# EAGLE design shem (EAGLE 8.0.2)
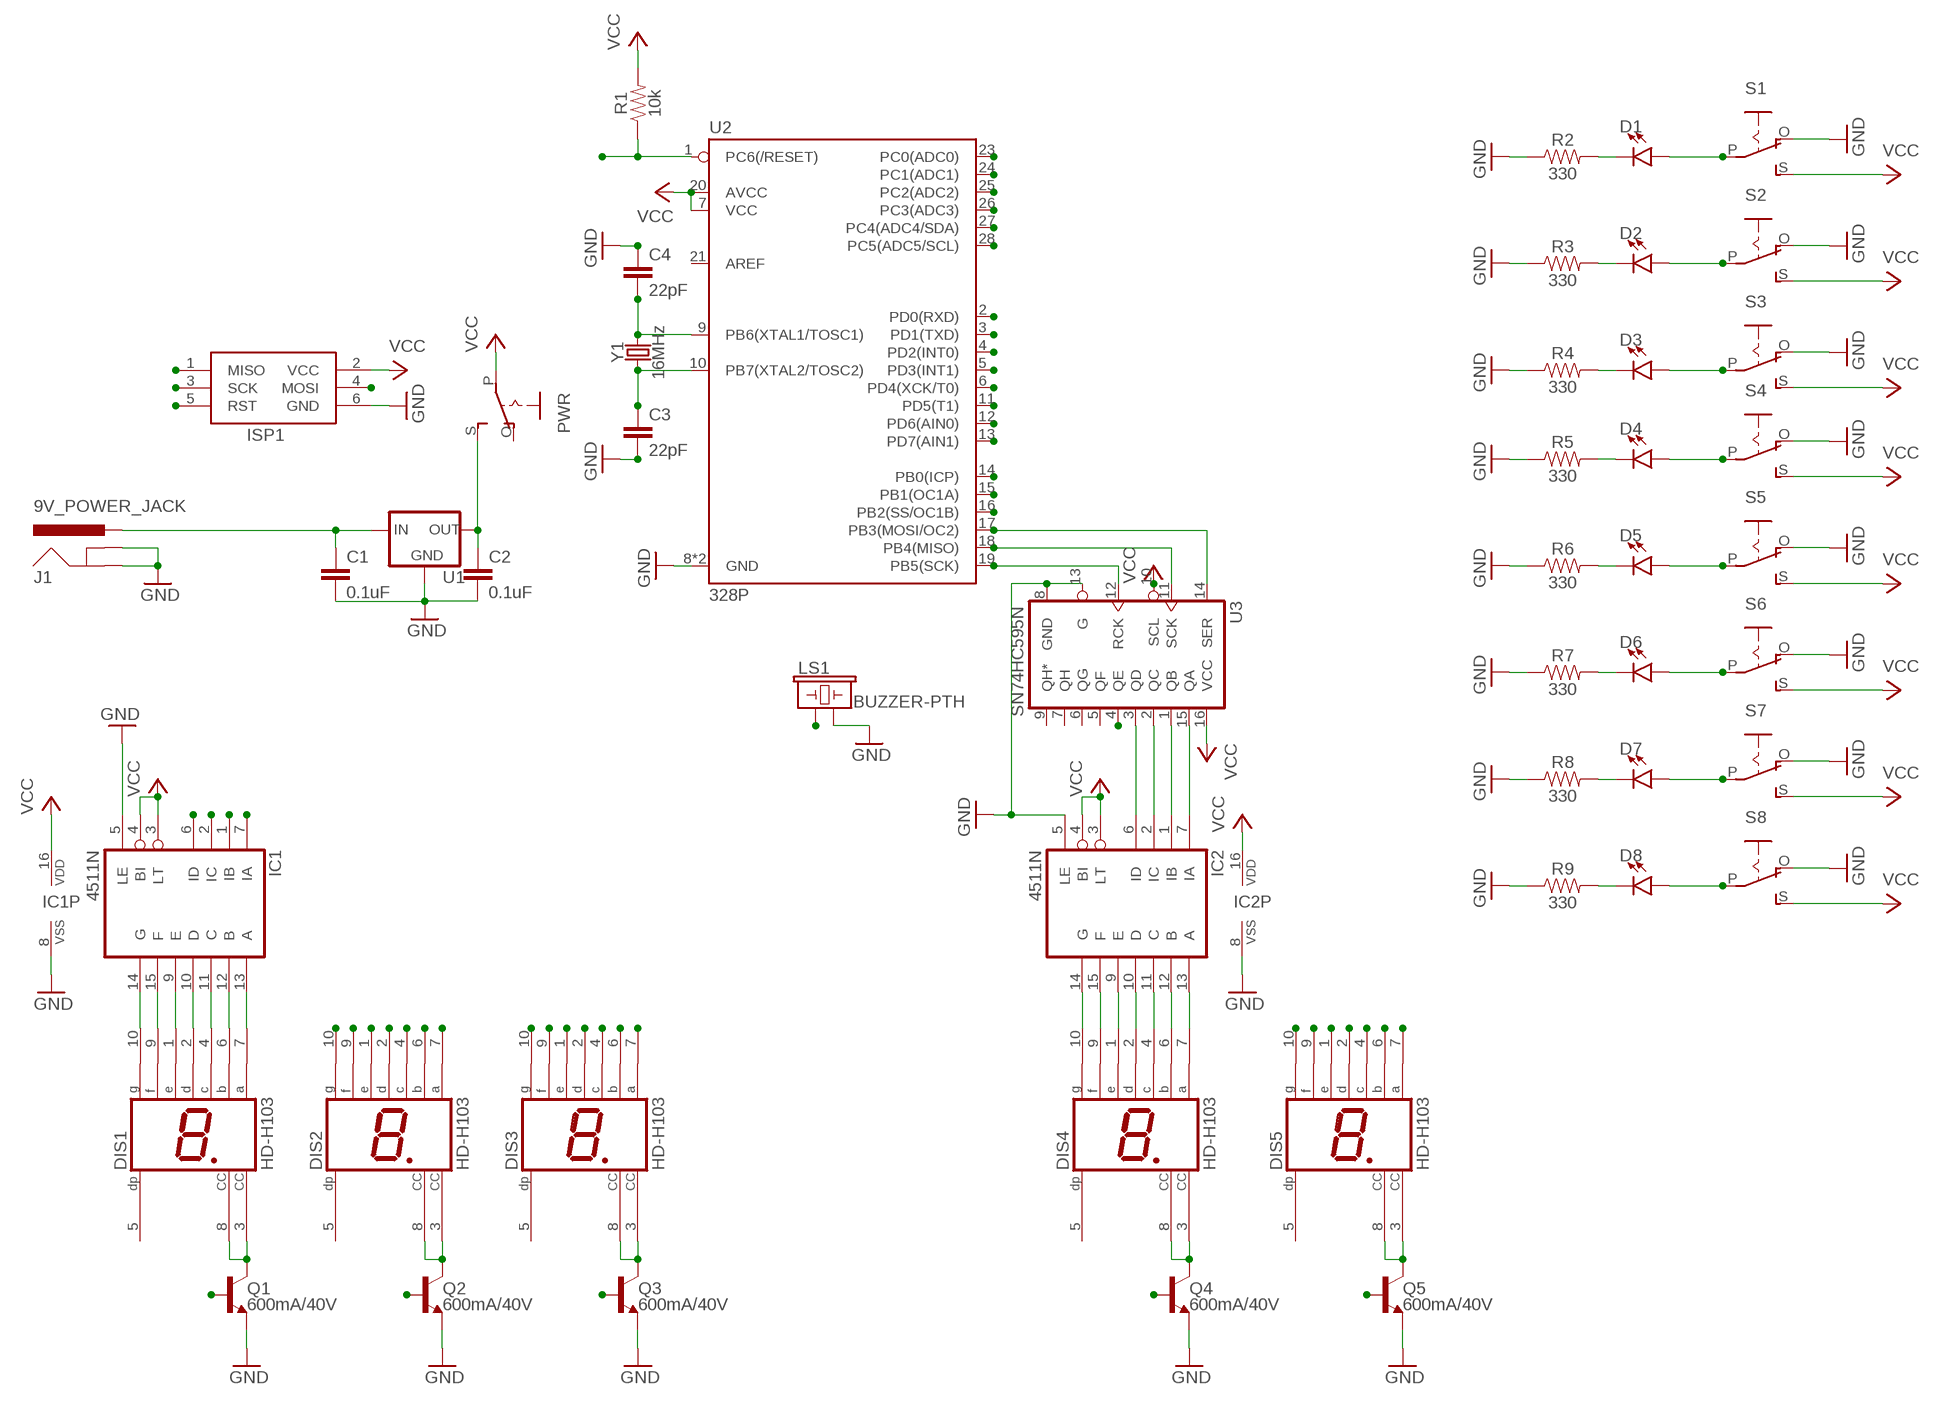
[diagram p0: schematic, sheet 1]

## Parts
C1  0.1uF  0.1UF-KIT-EZ-50V-20%  [CAP-PTH-SMALL-KIT]
C2  0.1uF  0.1UF-KIT-EZ-50V-20%  [CAP-PTH-SMALL-KIT]
C3  22pF  22PF-PTH-2.54MM-200V-5%  [CAP-PTH-2.54]
C4  22pF  22PF-PTH-2.54MM-200V-5%  [CAP-PTH-2.54]
D1  LED3MM  [LED_3MM]
D2  LED3MM  [LED_3MM]
D3  LED3MM  [LED_3MM]
D4  LED3MM  [LED_3MM]
D5  LED3MM  [LED_3MM]
D6  LED3MM  [LED_3MM]
D7  LED3MM  [LED_3MM]
D8  LED3MM  [LED_3MM]
DIS1  HD-H103  [HDSP-M]
DIS2  HD-H103  [HDSP-M]
DIS3  HD-H103  [HDSP-M]
DIS4  HD-H103  [HDSP-M]
DIS5  HD-H103  [HDSP-M]
IC1  4511N  [DIL16]
IC2  4511N  [DIL16]
ISP1  AVRISP-6  [AVRISP]
J1  9V_POWER_JACK  POWER_JACK  [POWER_JACK_PTH]
LS1  BUZZER-PTH  [BUZZER-12MM]
PWR  EG1218S  [EG1218]
Q1  600mA/40V  TRANS_NPN-P2N2222A  [TO-92]
Q2  600mA/40V  TRANS_NPN-P2N2222A  [TO-92]
Q3  600mA/40V  TRANS_NPN-P2N2222A  [TO-92]
Q4  600mA/40V  TRANS_NPN-P2N2222A  [TO-92]
Q5  600mA/40V  TRANS_NPN-P2N2222A  [TO-92]
R1  10k  10KOHM-HORIZ-1/6W-5%  [AXIAL-0.3]
R2  330  330OHM-HORIZ-1/10W-5%  [AXIAL-0.3]
R3  330  330OHM-HORIZ-1/10W-5%  [AXIAL-0.3]
R4  330  330OHM-HORIZ-1/10W-5%  [AXIAL-0.3]
R5  330  330OHM-HORIZ-1/10W-5%  [AXIAL-0.3]
R6  330  330OHM-HORIZ-1/10W-5%  [AXIAL-0.3]
R7  330  330OHM-HORIZ-1/10W-5%  [AXIAL-0.3]
R8  330  330OHM-HORIZ-1/10W-5%  [AXIAL-0.3]
R9  330  330OHM-HORIZ-1/10W-5%  [AXIAL-0.3]
S1  EG1218S  [EG1218]
S2  EG1218S  [EG1218]
S3  EG1218S  [EG1218]
S4  EG1218S  [EG1218]
S5  EG1218S  [EG1218]
S6  EG1218S  [EG1218]
S7  EG1218S  [EG1218]
S8  EG1218S  [EG1218]
U1  V_REG_78XXSIDE  [78XXL]
U2  328P  ATMEGA328P_PDIP  [DIP28]
U3  SN74HC595N  74HC595N  [DIP16]
Y1  16MHz  CRYSTAL-16MHZPTH-HC49US  [HC49US]

## Nets
9V: C1.1 J1.PWR U1.IN
BUZZ: LS1.+ U3.4(QE)
GND: C1.2 C2.2 C3.2 C4.1 IC1.5(LE) IC1.8(VSS) IC2.5(LE) IC2.8(VSS) ISP1.6(GND) J1.GND J1.GNDBREAK LS1.- Q1.3(E) Q2.3(E) Q3.3(E) Q4.3(E) Q5.3(E) R2.P$1 R3.P$1 R4.P$1 R5.P$1 R6.P$1 R7.P$1 R8.P$1 R9.P$1 S1.O S2.O S3.O S4.O S5.O S6.O S7.O S8.O U1.GND U2.8(GND) U2.22(GND) U3.8(GND) U3.13(G)
HUNDREDS_ENABLE: Q1.2(B) U2.16(PB2(SS/OC1B))
IA: IC1.7(IA) U2.23(PC0(ADC0))
IB: IC1.1(IB) U2.24(PC1(ADC1))
IC: IC1.2(IC) U2.25(PC2(ADC2))
ID: IC1.6(ID) U2.26(PC3(ADC3))
MISO: ISP1.1(MISO) U2.18(PB4(MISO)) U3.11(SCK)
MOSI: ISP1.4(MOSI) U2.17(PB3(MOSI/OC2)) U3.14(SER)
N$1: C2.1 PWR.S U1.OUT
N$2: C3.1 U2.10(PB7(XTAL2/TOSC2)) Y1.1
N$3: C4.2 U2.9(PB6(XTAL1/TOSC1)) Y1.2
N$4: DIS1.3(CC) DIS1.8(CC) Q1.1(C)
N$5: IC2.7(IA) U3.15(QA)
N$6: DIS2.3(CC) DIS2.8(CC) Q2.1(C)
N$7: IC2.1(IB) U3.1(QB)
N$8: DIS3.3(CC) DIS3.8(CC) Q3.1(C)
N$9: IC2.2(IC) U3.2(QC)
N$10: IC2.6(ID) U3.3(QD)
N$11: DIS4.3(CC) DIS4.8(CC) Q4.1(C)
N$12: D1.K(C) R2.P$2
N$13: D8.K(C) R9.P$2
N$14: D7.K(C) R8.P$2
N$15: D6.K(C) R7.P$2
N$16: DIS5.3(CC) DIS5.8(CC) Q5.1(C)
N$17: D5.K(C) R6.P$2
N$18: D4.K(C) R5.P$2
N$19: D3.K(C) R4.P$2
N$20: D2.K(C) R3.P$2
NUM_A: DIS1.7(A) DIS2.7(A) DIS3.7(A) IC1.13(A)
NUM_B: DIS1.6(B) DIS2.6(B) DIS3.6(B) IC1.12(B)
NUM_C: DIS1.4(C) DIS2.4(C) DIS3.4(C) IC1.11(C)
NUM_D: DIS1.2(D) DIS2.2(D) DIS3.2(D) IC1.10(D)
NUM_E: DIS1.1(E) DIS2.1(E) DIS3.1(E) IC1.9(E)
NUM_F: DIS1.9(F) DIS2.9(F) DIS3.9(F) IC1.15(F)
NUM_G: DIS1.10(G) DIS2.10(G) DIS3.10(G) IC1.14(G)
ONES_ENABLE: Q3.2(B) U2.14(PB0(ICP))
RST: ISP1.5(RST) R1.P$1 U2.1(PC6(/RESET))
S0: D1.A S1.P U2.2(PD0(RXD))
S1: D2.A S2.P U2.3(PD1(TXD))
S2: D3.A S3.P U2.4(PD2(INT0))
S3: D4.A S4.P U2.5(PD3(INT1))
S4: D5.A S5.P U2.6(PD4(XCK/T0))
S5: D6.A S6.P U2.11(PD5(T1))
S6: D7.A S7.P U2.12(PD6(AIN0))
S7: D8.A S8.P U2.13(PD7(AIN1))
SCK: ISP1.3(SCK) U2.19(PB5(SCK)) U3.12(RCK)
SCORE_A: DIS4.7(A) DIS5.7(A) IC2.13(A)
SCORE_B: DIS4.6(B) DIS5.6(B) IC2.12(B)
SCORE_C: DIS4.4(C) DIS5.4(C) IC2.11(C)
SCORE_D: DIS4.2(D) DIS5.2(D) IC2.10(D)
SCORE_E: DIS4.1(E) DIS5.1(E) IC2.9(E)
SCORE_F: DIS4.9(F) DIS5.9(F) IC2.15(F)
SCORE_G: DIS4.10(G) DIS5.10(G) IC2.14(G)
SCORE_ONES_ENABLE: Q4.2(B) U2.28(PC5(ADC5/SCL))
SCORE_TENS_ENABLE: Q5.2(B) U2.27(PC4(ADC4/SDA))
TENS_ENABLE: Q2.2(B) U2.15(PB1(OC1A))
VCC: IC1.3(LT) IC1.4(BI) IC1.16(VDD) IC2.3(LT) IC2.4(BI) IC2.16(VDD) ISP1.2(VCC) PWR.P R1.P$2 S1.S S2.S S3.S S4.S S5.S S6.S S7.S S8.S U2.7(VCC) U2.20(AVCC) U3.10(SCL) U3.16(VCC)
Unconnected: DIS1.5(DP) DIS2.5(DP) DIS3.5(DP) DIS4.5(DP) DIS5.5(DP) PWR.O U2.21(AREF) U3.5(QF) U3.6(QG) U3.7(QH) U3.9(QH*)

## Library data of the parts
C1 C2 = SparkFun-Capacitors:0.1UF: 0.1µF ceramic capacitors A capacitor is a passive two-terminal electrical component used to store electrical energy temporarily in an electric field.; PROD_ID: CAP-08370
C3 C4 = SparkFun-Capacitors:22PF: 22pF ceramic capacitors A capacitor is a passive two-terminal electrical component used to store electrical energy temporarily in an electric field.; PROD_ID: CAP-09128
D1-D8 = SparkFun-LED:LED: LED (Generic) Standard schematic elements and footprints for 5mm, 3mm, 1206, and 0603 sized LEDs. Generic LEDs with no color specified.; PROD_ID: DIO-08794
DIS1-DIS5 = display-hp:HD-H103: LED DISPLAY 1-character 7 segment, decimal point right; OC_FARNELL: unknown; OC_NEWARK: unknown
IC1 IC2 = 45xx:4511: BCD to 7-segment LATCH/DECODER/DRIVER
ISP1 = adafruit:AVRISP: AVR ISP HEADER Standard 6 pin header for AVR programming
J1 = SparkFun-Connectors:POWER_JACK: Power Jack Connector This is the standard 5.5mm barrel jack for power. The PTH is the most common, proven, reliable, footprint. The Slot footprint only works if the mill layer is transmitted to the PCB fab house so be warned. Here are the connectors we sell at SparkFun: DC Barrel Power Jack/Connector <https://www.sparkfun.com/products/119> (PRT-00119) DC Barrel Power Jack/Connector (SMD) <https://www.sparkfun.com/products/12748> (PRT-12748) DC Barrel Jack Adapter - Breadboard Compatible <https://www.sparkfun.com/products/10811> (PRT-10811) It is used on this SparkFun product (and many, many others): SparkFun RedBoard - Programmed with Arduino <https://www.sparkfun.com/products/12757> (DEV-12757) Also, if you need a mating power supply or connector, please check these out: Wall Adapter Power Supply - 9VDC 650mA <https://www.sparkfun.com/products/298> (TOL-00298) DC Barrel Jack Adapter - Male <https://www.sparkfun.com/products/10287> (PRT-10287); PROD_ID: CONN-08197
LS1 = SparkFun-Electromechanical:BUZZER: Buzzer Small round buzzers that operate around the audible 2kHz range. You can use these as speakers to create simple music or user interfaces. Variant Overview: PTH - Mini Speaker - PC Mount 12mm 2.048kHz <https://www.sparkfun.com/products/7950> PTH_KIT - Mini Speaker - PC Mount 12mm 2.048kHz <https://www.sparkfun.com/products/7950> KIT simplifies soldering by adding stop mask to one side of the pads. PTH_NO_SILK - Mini Speaker - PC Mount 12mm 2.048kHz <https://www.sparkfun.com/products/7950> No silkscreen indicator of buzzer outline. PTH_KIT_NO_SILK - Mini Speaker - PC Mount 12mm 2.048kHz <https://www.sparkfun.com/products/7950> KIT package w/o silkscreen SMD - Buzzer Audio Magnetic (CCV-084B16) SMD buzzer used on, e.g. the LilyPad Buzzer <https://www.sparkfun.com/products/8463> and RFID USB Reader <https://www.sparkfun.com/products/9963>. SMD_KIT - Buzzer Audio Magnetic (CCV-084B16) SMD Buzzer with elongated pins to make soldering easier. Used on the SparkFun Simon Says - Surface Mount Soldering Kit <https://www.sparkfun.com/products/10935>.; PROD_ID: COMP-08253; SF_SKU: COM-07950
PWR S1-S8 = adafruit:EG1218: SLIDING SWITCH 0.1" spacing through hole, vertical SPDT slide switch http://www.ladyada.net/library/pcb/eaglelibrary.html
Q1-Q5 = SparkFun-DiscreteSemi:TRANS_NPN: NPN transistor Current controlled devices typically used to amplify current or used as a switch. BC547 - COM-08928 <http://www.sparkfun.com/products/8928> (TO-92 45V 100mA) (1.Collector 2.Base 3.Emitter) 2N3904 - COM-00521 <http://www.sparkfun.com/products/521> (TO-92 40V 200mA) (1.Emitter 2.Base 3.Collector) P2N2222A - COM-12852 <http://www.sparkfun.com/products/12852> (TO-92 40V 600mA) (1.Collector 2.Base 3.Emitter); PROD_ID: TRANS-09536
R1 = SparkFun-Resistors:10KOHM: 10kΩ resistor A resistor is a passive two-terminal electrical component that implements electrical resistance as a circuit element. Resistors act to reduce current flow, and, at the same time, act to lower voltage levels within circuits. - Wikipedia; PROD_ID: RES-08375
R2-R9 = SparkFun-Resistors:330OHM: 330Ω resistor A resistor is a passive two-terminal electrical component that implements electrical resistance as a circuit element. Resistors act to reduce current flow, and, at the same time, act to lower voltage levels within circuits. - Wikipedia; PROD_ID: RES-8371
U1 = SparkFun-IC-Power:V_REG_78XX: Voltage Regulator Standard 78xx regulator. IGO (Input Ground Output). Spark Fun Electronics SKU : COM-00107
U2 = SparkFun-IC-Microcontroller:ATMEGA328P_PDIP: Atmel 328P Through hole ATMEGA328P uC used in the Arduino 32kb flash, 1k EEPROM, 2k SRAM Datasheet <http://www.sparkfun.com/datasheets/Components/SMD/ATMega328.pdf> SparkFun Products Storefront component: AVR 28 Pin 20MHz 32K 6A/D - ATMega328P <https://www.sparkfun.com/products/9061> (COM-09061) SparkFun Simon Says - Through-Hole Soldering Kit <https://www.sparkfun.com/products/10547> (KIT-10547) SparkFun Learn to Solder - Simon Says <https://www.sparkfun.com/products/13708> (KIT-13708) SparkFun BigTime Watch Kit <https://www.sparkfun.com/products/11734> (KIT-11734) SparkFun ClockIt <https://www.sparkfun.com/products/10930> (KIT-10930) SparkFun Serial Enabled LCD Kit <https://www.sparkfun.com/products/10097> (LCD-10097) SparkFun Simon Tilts - Through Hole Soldering Kit <https://www.sparkfun.com/products/12634> (KIT-12634) SparkFun Frequency Counter Kit <https://www.sparkfun.com/products/10140> (KIT-10140) FabFM Radio Kit <https://www.sparkfun.com/products/11043> (KIT-11043) SparkFun Binary Blaster Kit <https://www.sparkfun.com/products/12037> (KIT-12037) SparkFun Metro-Gnome <https://www.sparkfun.com/products/9236> (KIT-09236) ATmega328 with Arduino Optiboot (Uno) <https://www.sparkfun.com/products/10524> (DEV-10524); PROD_ID: IC-09136
U3 = SparkFun-IC-Logic:74*595: 8-Bit Shift Register (Serial to Parallel) Datasheet <http://cdn.sparkfun.com/datasheets/BreakoutBoards/MM74HC595.pdf> SparkFun Products SparkFun Shift Register Breakout - 74HC595 <https://www.sparkfun.com/products/10680> (BOB-10680); PROD_ID: IC-13123
Y1 = SparkFun-Clocks:CRYSTAL-16MHZ: 16MHz Crystal Digikey Example <http://www.digikey.com/product-search/en?keywords=535-9122-1-ND> Frequency: 16MHz Frequency Stability: ±50ppm Frequency Tolerance: ±20ppm Load Capacitance: 18pF SparkFun Products: Pro Micro -5V/16MHz <https://www.sparkfun.com/products/12640> SparkFun Serial Enabled LCD Kit <https://www.sparkfun.com/products/10097>; PROD_ID: XTAL-08181; SF_ID: COM-00536

## Board
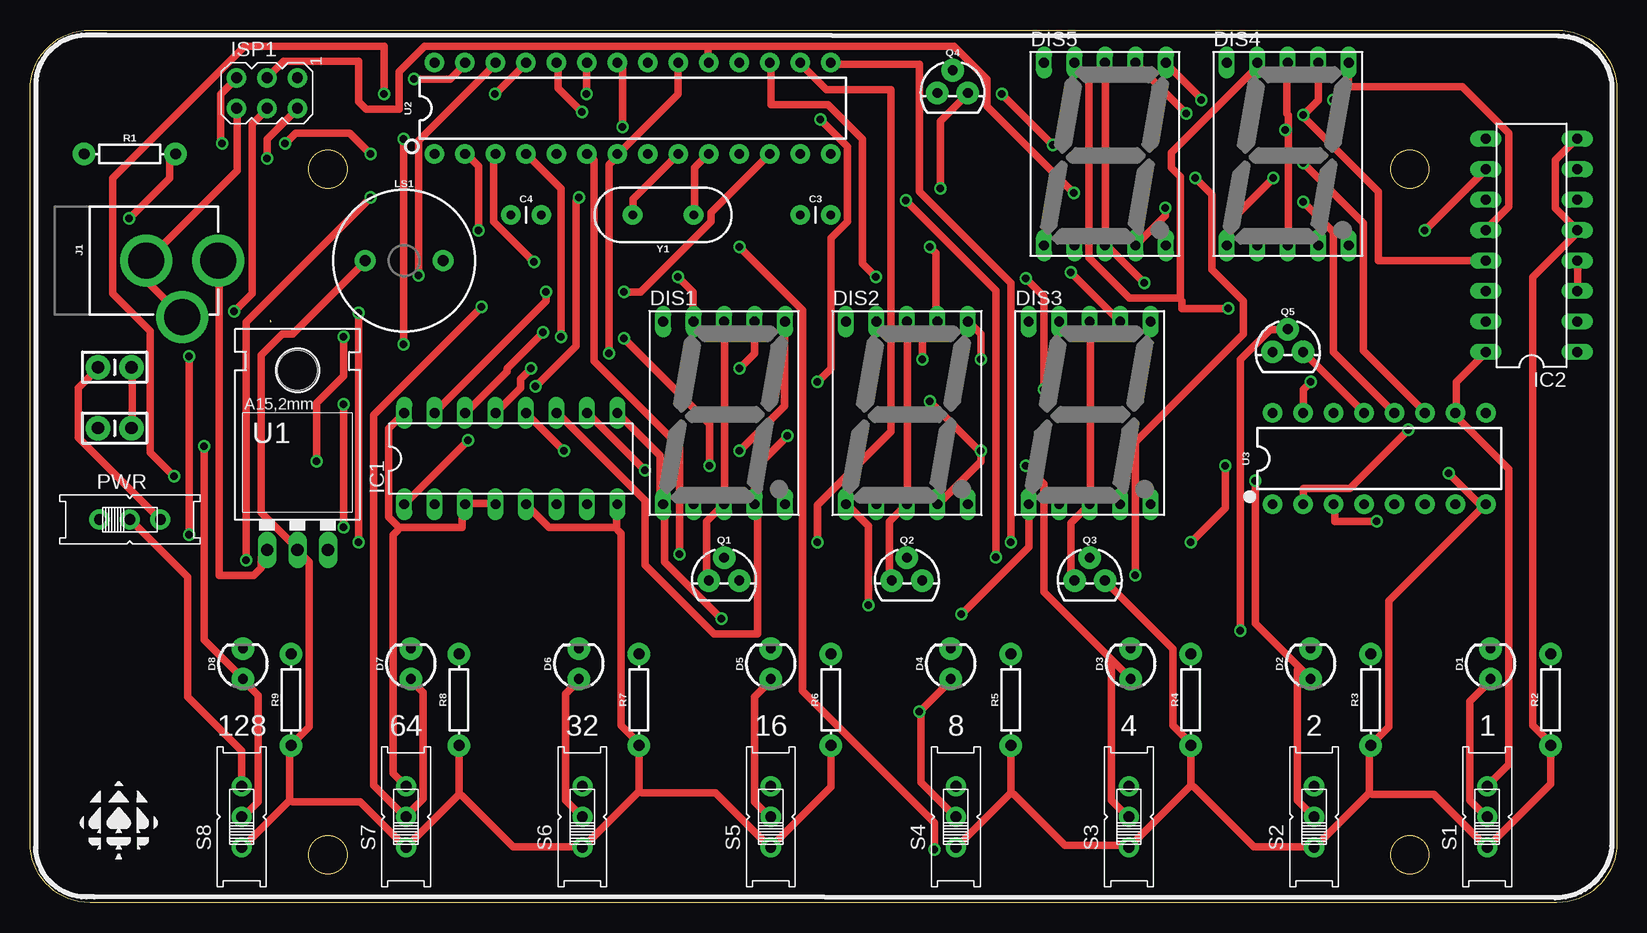
[diagram p1: board, top side]
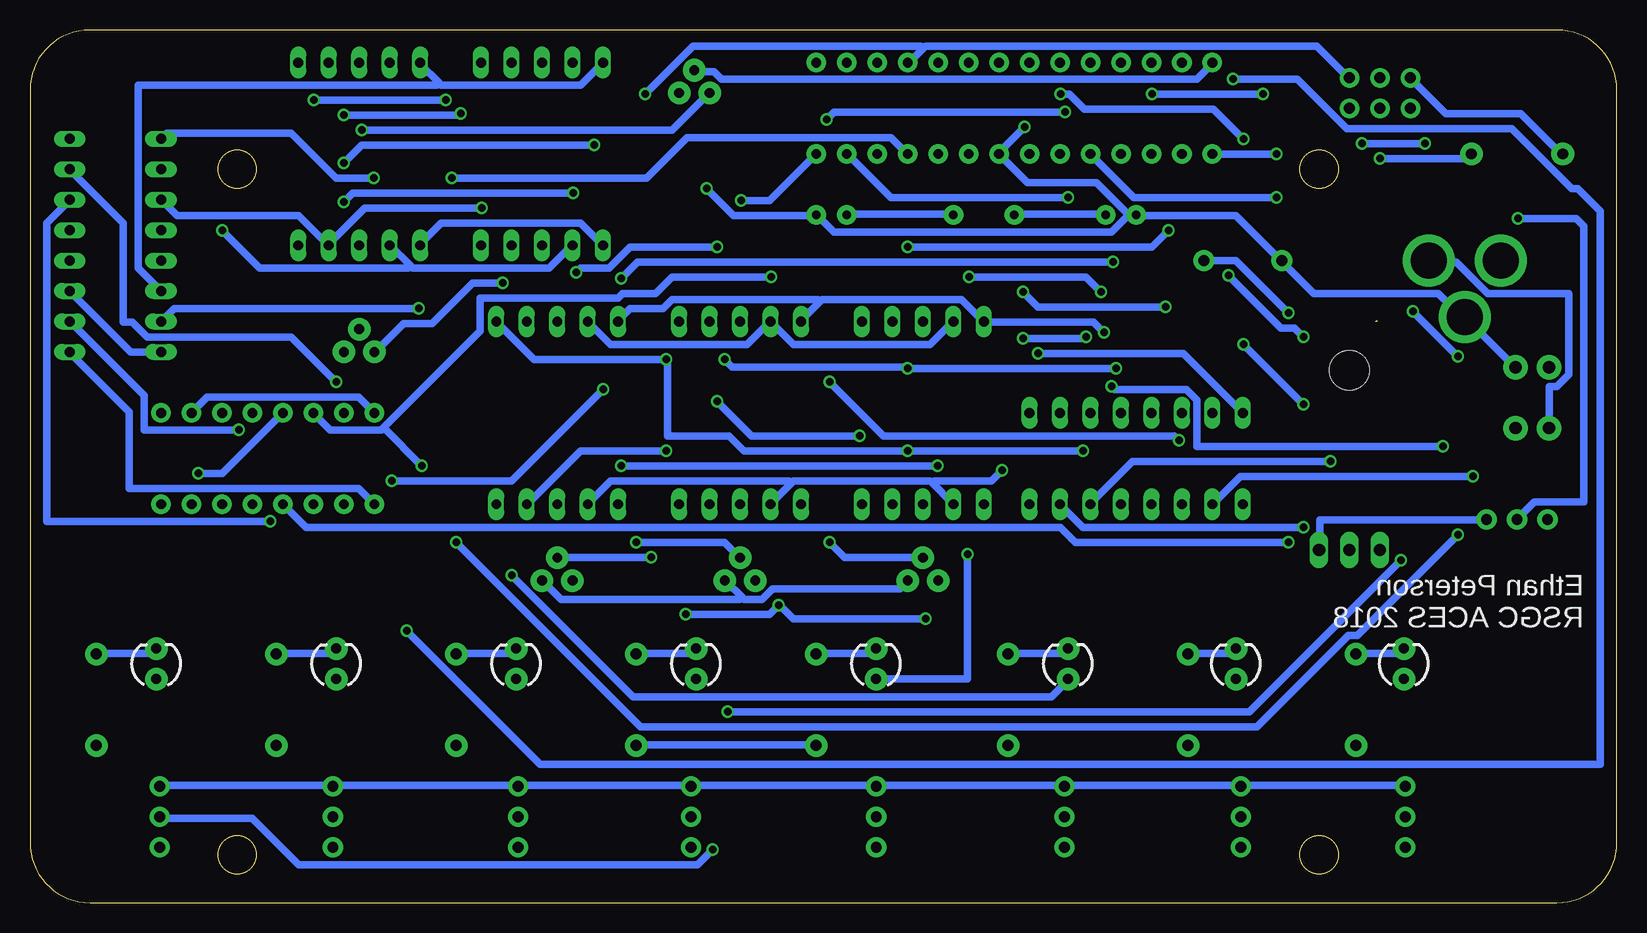
[diagram p2: board, bottom side, seen from below]

Size 132.29 x 72.76 mm. Coordinates in mm from the lower left corner, seen from the top.
Outline: 20.02,48.49 arc90 20.07,48.44
Outline: 20.07,48.44 arc90 20.12,48.49
Outline: 20.07,48.44 arc-180 20.07,48.54 arc180 20.07,48.44
Outline: 0,5 0,67.76 arc-90 5,72.76 127.29,72.76 arc-90 132.29,67.76 132.29,5 arc-90 127.29,0 5,0 arc-90 0,5
Outline: circle at 24.84,4 radius 1.6
Outline: circle at 24.84,61.15 radius 1.6
Outline: circle at 115.01,4 radius 1.6
Outline: circle at 115.01,61.15 radius 1.6
Copper layers (1*16): Top 0.035mm / dielectric 1.5mm / Bottom 0.035mm
Design rules "default *": minimum track width 25mil, minimum drill 24mil, track to track 24mil, track to pad 8mil, pad to pad 8mil, via to via 8mil, smd to smd 8mil, copper to edge 40mil, drill to drill 8mil, minimum pad ring 10mil, minimum via ring 8mil, stop-mask expansion 4mil, vias tented up to drill 0mil, thermal gap 10mil

### Footprints (pad centres in the part's own frame; a part is rotated, then mirrored left to right if it is on the bottom)
CAP-PTH-SMALL-KIT = drill 1.016 pad 2.032: 1 -1.397,0; 2 1.397,0
CAP-PTH-2.54 = drill 0.7 pad 1.651: 1 -1.27,0; 2 1.27,0
LED_3MM = drill 0.813 pad 1.88: A -1.27,0; K 1.27,0
HDSP-M = drill 0.813 long: 1 -5.08,-7.62; 2 -2.54,-7.62; 3 0,-7.62; 4 2.54,-7.62; 5 5.08,-7.62; 6 5.08,7.62; 7 2.54,7.62; 8 0,7.62; 9 -2.54,7.62; 10 -5.08,7.62
DIL16 = drill 0.813 long: 1 -8.89,-3.81; 2 -6.35,-3.81; 3 -3.81,-3.81; 4 -1.27,-3.81; 5 1.27,-3.81; 6 3.81,-3.81; 7 6.35,-3.81; 8 8.89,-3.81; 9 8.89,3.81; 10 6.35,3.81; 11 3.81,3.81; 12 1.27,3.81; 13 -1.27,3.81; 14 -3.81,3.81; 15 -6.35,3.81; 16 -8.89,3.81
AVRISP = drill 0.9 pad 1.626: 1 -1.27,2.54; 2 1.27,2.54; 3 -1.27,0; 4 1.27,0; 5 -1.27,-2.54; 6 1.27,-2.54
POWER_JACK_PTH = drill 2.997 pad 4.318: GND 0,7.7; GNDBREAK 4.7,10.7; PWR 0,13.7
BUZZER-12MM = drill 0.9 pad 1.778: + 3.25,0; - -3.25,0
EG1218 = drill 0.9 pad 1.676: O -2.54,0; P 0,0; S 2.54,0
TO-92 = drill 0.813 pad 1.88: 1 -1.27,0; 2 0,1.905; 3 1.27,0
AXIAL-0.3 = drill 0.9 pad 1.88: P$1 -3.81,0; P$2 3.81,0
78XXL = drill 1.016 long: GND 0,-3.81; IN -2.54,-3.81; OUT 2.54,-3.81 | hole 3.302: 0,11.176
DIP28 = drill 0.813 pad 1.626: 1 -16.51,-3.81; 2 -13.97,-3.81; 3 -11.43,-3.81; 4 -8.89,-3.81; 5 -6.35,-3.81; 6 -3.81,-3.81; 7 -1.27,-3.81; 8 1.27,-3.81; 9 3.81,-3.81; 10 6.35,-3.81; 11 8.89,-3.81; 12 11.43,-3.81; 13 13.97,-3.81; 14 16.51,-3.81; 15 16.51,3.81; 16 13.97,3.81; 17 11.43,3.81; 18 8.89,3.81; 19 6.35,3.81; 20 3.81,3.81; 21 1.27,3.81; 22 -1.27,3.81; 23 -3.81,3.81; 24 -6.35,3.81; 25 -8.89,3.81; 26 -11.43,3.81; 27 -13.97,3.81; 28 -16.51,3.81
DIP16 = drill 0.813 pad 1.626: 1 -8.89,-3.81; 2 -6.35,-3.81; 3 -3.81,-3.81; 4 -1.27,-3.81; 5 1.27,-3.81; 6 3.81,-3.81; 7 6.35,-3.81; 8 8.89,-3.81; 9 8.89,3.81; 10 6.35,3.81; 11 3.81,3.81; 12 1.27,3.81; 13 -1.27,3.81; 14 -3.81,3.81; 15 -6.35,3.81; 16 -8.89,3.81
HC49US = drill 0.7 pad 1.651: 1 -2.54,0; 2 2.54,0

### Placement (x,y rotation side)
C1  7.06,39.56 0 top
C2  7.06,44.64 0 top
C3  65.48,57.34 0 top
C4  41.35,57.34 0 top
D1  121.76,19.92 90 top
D2  106.76,19.92 90 top
D3  91.76,19.92 90 top
D4  76.76,19.92 90 top
D5  61.76,19.92 90 top
D6  45.76,19.92 90 top
D7  31.76,19.92 90 top
D8  17.76,19.92 90 top
DIS1  57.86,40.83 0 top
DIS2  73.1,40.83 0 top
DIS3  88.34,40.83 0 top
DIS4  104.85,62.42 0 top
DIS5  89.61,62.42 0 top
IC1  40.08,37.02 0 top
IC2  125.17,54.8 90 top
ISP1  19.76,67.5 270 top
J1  1.98,53.53 270 top
LS1  31.19,53.53 0 top
PWR  8.33,31.94 0 top
Q1  57.86,26.86 0 top
Q2  73.1,26.86 0 top
Q3  88.34,26.86 0 top
Q4  76.91,67.5 0 top
Q5  104.85,45.91 0 top
R1  8.33,62.42 0 top
R2  126.76,16.92 90 top
R3  111.76,16.92 90 top
R4  96.76,16.92 90 top
R5  81.76,16.92 90 top
R6  66.76,16.92 90 top
R7  50.76,16.92 90 top
R8  35.76,16.92 90 top
R9  21.76,16.92 90 top
S1  121.47,7.16 90 top
S2  107.04,7.16 90 top
S3  91.61,7.16 90 top
S4  77.18,7.16 90 top
S5  61.75,7.16 90 top
S6  46.05,7.16 90 top
S7  31.35,7.16 90 top
S8  17.65,7.16 90 top
U1  22.3,33.21 0 top
U2  50.24,66.23 0 top
U3  112.47,37.02 0 top
Y1  52.78,57.34 180 top

### Tracks (layer width: path | path; a pad name or v marks a point on that pad's centre or on a via)
9V
  Top 0.635: U1.IN 19.76,29.3 19.26,28.8 19.26,27.92 18.63,27.3 15.76,27.3 15.76,53.42 J1.PWR
  Bottom 0.635: C1.1 5.63,39.67 5.63,43.05 5.01,43.05 4.01,44.05 4.01,50.8 10.76,50.8 13.38,53.42 15.63,53.42 J1.PWR
BUZZ  (via drill 0.61)
  Top 0.635: v27.38,49.17 v27.38,30.05
  Bottom 0.635: v27.38,30.05 45.13,30.05 46.38,31.3 109.26,31.3 111.13,33.17 U3.4 | v27.38,49.17 31.76,53.55 34.38,53.55 LS1.+
GND  (via drill 0.61)
  Top 0.635: C1.2 8.51,39.67 8.51,44.55 C2.2 | ISP1.6 17.26,66.17 17.26,61.05 9.76,53.55 J1.GND 9.88,53.3 9.88,51.67 12.63,48.92 J1.GNDBREAK | v49.38,64.67 49.38,69.55 49.01,69.92 U2.22 | v75.88,59.55 75.88,65.17 78.13,67.42 Q4.3 | 35.76,9.04 31.38,4.67 S7.O 31.13,4.79 27.51,8.42 21.88,8.42 21.63,8.54 | R8.P$1 35.76,9.04 | 21.63,8.54 17.76,4.67 S8.O | 21.63,8.54 21.63,12.79 R9.P$1 21.76,13.17 23.26,14.67 23.26,28.42 22.38,29.3 U1.GND 22.13,29.67 19.26,32.55 19.26,45.67 21.01,47.42 21.88,47.42 27.88,53.42 LS1.- | R6.P$1 66.76,9.67 61.76,4.67 S5.O 61.51,4.79 57.13,9.17 51.01,9.17 50.76,9.29 | 48.88,31.3 43.26,31.3 41.38,33.17 IC1.5 | 48.88,31.3 48.88,33.17 IC1.8 | 50.76,9.29 46.13,4.67 S6.O 45.76,4.67 40.26,4.67 36.01,8.92 35.76,9.04 | 50.76,9.29 R7.P$1 50.63,13.42 49.26,14.79 49.26,30.8 49.01,31.05 48.88,31.3 | IC2.8 128.88,63.67 127.13,61.92 127.13,57.92 128.88,56.17 IC2.5 128.88,55.8 125.26,52.17 125.26,14.79 126.63,13.42 R2.P$1 126.76,9.92 121.51,4.67 S1.O 121.26,4.79 117.01,9.04 111.88,9.04 111.63,9.17 | 81.76,9.17 77.26,4.67 S4.O | R5.P$1 81.76,9.17 | 96.76,9.79 91.63,4.67 S3.O 91.38,4.79 86.26,4.79 82.01,9.04 81.76,9.17 | 96.76,9.79 R4.P$1 96.63,13.42 95.26,14.79 95.26,21.17 89.63,26.8 Q3.3 | U3.13 111.13,40.92 106.13,45.92 Q5.3 | 111.63,9.17 107.13,4.67 S2.O 106.76,4.67 102.01,4.67 97.01,9.67 96.76,9.79 | 111.63,9.17 111.63,12.79 R3.P$1 111.76,13.17 113.26,14.67 113.26,25.17 121.26,33.17 U3.8 120.88,33.17 v118.26,35.8
  Bottom 0.635: C2.2 8.51,44.67 12.63,48.8 J1.GNDBREAK 13.01,48.92 14.88,50.8 25.26,50.8 27.76,53.3 LS1.- 28.01,53.55 31.76,57.3 39.76,57.3 C4.1 | C4.1 40.13,57.42 40.76,57.42 43.38,60.05 49.13,60.05 U2.8 51.38,62.67 v49.38,64.67 | C4.1 40.88,57.17 42.13,55.92 65.26,55.92 66.63,57.3 C3.2 67.01,57.3 73.63,57.3 v75.88,59.55 | 72.95,25.48 74.26,26.8 Q2.3 | 72.95,25.48 72.76,25.3 71.26,25.3 70.38,26.17 59.76,26.17 59.13,26.8 Q1.3 | Q3.3 89.51,26.8 88.01,25.3 73.13,25.3 72.95,25.48 | v118.26,35.8 116.26,35.8 111.26,40.8 U3.13 | R6.P$1 66.76,13.17 81.76,13.17 R5.P$1
HUNDREDS_ENABLE  (via drill 0.61)
  Top 0.635: v65.63,30.05 65.63,33.17 71.76,39.3 71.76,67.8 66.38,67.8 64.26,69.92 U2.16
  Bottom 0.635: v65.63,30.05 64.38,28.8 57.88,28.8 Q1.2
IA  (via drill 0.61)
  Top 0.635: v26.13,41.55 v26.13,31.3 | v31.13,63.67 v31.13,46.55 | v46.38,67.42 46.38,69.92 U2.23
  Bottom 0.635: v26.13,31.3 44.51,31.3 46.38,33.17 IC1.7 | v31.13,46.55 v26.13,41.55 | v31.13,63.67 33.63,66.17 44.38,66.17 45.63,67.42 v46.38,67.42
IB  (via drill 0.61)
  Top 0.635: v36.51,38.55 31.26,33.3 IC1.1 | v65.63,43.42 66.76,44.55 66.76,55.42 68.13,56.8 68.13,63.05 v65.88,65.3 | v46.01,65.92 44.01,67.92 44.01,69.92 U2.24
  Bottom 0.635: v36.51,38.55 36.88,38.92 61.13,38.92 v65.63,43.42 | v65.88,65.3 65.26,65.92 v46.01,65.92
IC  (via drill 0.61)
  Top 0.635: v12.01,35.55 10.01,37.55 10.01,47.67 6.88,50.8 6.88,60.42 17.88,71.42 29.51,71.42 v29.51,67.42 | v38.76,67.42 41.26,69.92 U2.25
  Bottom 0.635: v12.01,35.55 31.38,35.55 33.63,33.3 IC1.2 | v38.76,67.42 v29.51,67.42
ID  (via drill 0.61)
  Top 0.635: v23.88,36.8 23.88,41.67 26.13,43.92 v26.13,47.17 | v32.38,52.3 32.38,63.55 38.76,69.92 U2.26
  Bottom 0.635: v23.88,36.8 40.38,36.8 43.88,33.3 IC1.6 | v26.13,47.17 26.88,47.92 28.01,47.92 v32.38,52.3
MISO  (via drill 0.61)
  Top 0.635: v106.13,61.67 111.13,56.67 111.13,46.05 116.26,40.92 U3.11 | v81.01,67.42 v85.26,63.17
  Bottom 0.635: 57.82,71.23 59.01,70.05 U2.18 | 57.82,71.23 57.63,71.42 25.01,71.42 22.38,68.8 ISP1.1 | v106.13,61.67 104.63,63.17 v85.26,63.17 | v81.01,67.42 77.01,71.42 58.01,71.42 57.82,71.23
MOSI  (via drill 0.61)
  Top 0.635: v70.51,52.17 69.38,53.3 69.38,63.67 66.51,66.55 61.76,66.55 61.76,69.92 U2.17 | v17.01,49.3 18.51,50.8 18.51,64.92 19.76,66.17 ISP1.4 | v13.26,30.67 v13.26,45.55 | v96.76,30.05 99.63,32.92 v99.63,36.42
  Bottom 0.635: 102.82,39.61 94.76,47.67 94.76,50.42 83.26,50.42 82.88,50.8 80.13,50.8 78.76,52.17 v70.51,52.17 | 102.82,39.61 103.01,39.42 107.26,39.42 108.63,40.8 U3.14 | v13.26,45.55 v17.01,49.3 | v13.26,30.67 21.63,22.3 22.38,22.3 30.01,14.67 81.38,14.67 v96.76,30.05 | 102.82,39.61 v99.63,36.42
N$1
  Top 0.635: C2.1 5.63,44.55 4.01,42.92 4.01,38.8 10.76,32.05 PWR.S
  Bottom 0.635: U1.OUT 24.76,29.42 24.76,31.92 10.88,31.92 PWR.S
N$2
  Top 0.635: U2.10 56.51,62.42 55.38,61.3 55.38,57.42 Y1.1
  Bottom 0.635: C3.1 64.13,57.42 55.38,57.42 Y1.1
N$3
  Top 0.635: U2.9 54.01,62.42 50.26,58.67 50.26,57.42 Y1.2
  Bottom 0.635: C4.2 42.63,57.42 50.13,57.42 Y1.2
N$4
  Top 0.635: Q1.1 56.51,26.92 56.38,27.05 56.38,31.8 57.76,33.17 DIS1.3 57.88,33.42 57.88,48.42 DIS1.8
N$5  (via drill 0.61)
  Top 0.635: v106.76,43.42 106.13,42.8 106.13,40.92 U3.15
  Bottom 0.635: v106.76,43.42 110.51,47.17 122.51,47.17 123.76,48.42 124.51,48.42 124.51,56.67 128.88,61.05 IC2.7
N$6
  Top 0.635: Q2.1 71.76,26.92 71.63,27.05 71.63,31.8 73.01,33.17 DIS2.3 73.13,33.42 73.13,48.42 DIS2.8
N$7
  Bottom 0.635: IC2.1 128.88,45.8 124.01,40.92 124.01,34.55 104.88,34.55 103.63,33.3 U3.1
N$8
  Top 0.635: Q3.1 86.76,27.17 86.76,31.67 88.26,33.17 DIS3.3 88.38,33.42 88.38,48.42 DIS3.8
N$9  (via drill 0.61)
  Top 0.635: v114.88,39.42 110.01,34.55 106.13,34.55 106.13,33.3 U3.2
  Bottom 0.635: v114.88,39.42 122.76,39.42 122.76,42.3 128.88,48.42 IC2.2
N$10  (via drill 0.61)
  Top 0.635: v112.26,31.8 108.76,31.8 108.76,33.17 U3.3
  Bottom 0.635: v112.26,31.8 130.88,31.8 130.88,56.67 129.01,58.55 IC2.6
N$11  (via drill 0.61)
  Top 0.635: 104.88,64.42 104.88,65.67 104.76,65.8 104.76,69.92 DIS4.8 | 104.88,64.42 104.88,54.92 DIS4.3 | v104.63,64.42 104.88,64.42
  Bottom 0.635: v104.63,64.42 78.76,64.42 75.76,67.42 Q4.1
N$12
  Bottom 0.635: D1.K 121.76,21.17 122.13,20.8 126.76,20.8 R2.P$2
N$13
  Bottom 0.635: D8.K 17.76,21.17 18.13,20.8 21.76,20.8 R9.P$2
N$14
  Bottom 0.635: D7.K 31.76,21.17 32.13,20.8 35.76,20.8 R8.P$2
N$15
  Bottom 0.635: D6.K 45.76,21.17 46.13,20.8 50.76,20.8 R7.P$2
N$16  (via drill 0.61)
  Top 0.635: DIS5.8 89.63,69.92 89.63,54.92 DIS5.3 89.88,54.67 v92.88,51.67
  Bottom 0.635: v92.88,51.67 95.38,51.67 98.76,48.3 101.13,48.3 103.51,45.92 Q5.1
N$17
  Bottom 0.635: D5.K 61.76,21.17 62.13,20.8 66.76,20.8 R6.P$2
N$18
  Bottom 0.635: D4.K 76.76,21.17 77.13,20.8 81.76,20.8 R5.P$2
N$19
  Bottom 0.635: D3.K 91.76,21.17 92.13,20.8 96.76,20.8 R4.P$2
N$20
  Bottom 0.635: D2.K 106.76,21.17 107.13,20.8 111.76,20.8 R3.P$2
NUM_A  (via drill 0.61)
  Top 0.635: v41.76,44.55 40.88,43.67 40.88,42.92 38.88,40.92 IC1.13 | v59.13,44.55 60.38,45.8 60.38,48.42 DIS1.7 | v74.38,45.3 74.38,47.17 75.63,48.42 DIS2.7 75.51,48.67 75.51,54.17 v75.01,54.67 | v86.76,52.55 90.76,48.55 DIS3.7
  Bottom 0.635: v41.76,44.55 v59.13,44.55 59.38,44.67 73.76,44.67 v74.38,45.3 | v86.76,52.55 86.38,52.92 84.01,52.92 82.26,54.67 v75.01,54.67
NUM_B  (via drill 0.61)
  Top 0.635: v79.26,45.3 79.26,47.42 78.26,48.42 DIS2.6 | v44.51,37.67 IC1.12 | v59.13,37.67 62.88,41.42 62.88,48.42 DIS1.6
  Bottom 0.635: DIS3.6 93.38,48.42 90.26,45.3 v79.26,45.3 79.13,45.05 79.13,38.92 74.01,38.92 72.76,37.67 v59.13,37.67 v44.51,37.67
NUM_C  (via drill 0.61)
  Top 0.635: DIS2.4 75.76,33.3 79.26,36.8 v79.26,37.67 79.01,37.8 v75.01,41.8 | IC1.11 44.01,40.8 51.26,33.55 51.26,28.17 57.01,22.42 60.63,22.42 60.63,33.05 60.51,33.17 DIS1.4 60.38,33.55 60.38,36.17 v63.13,38.92
  Bottom 0.635: v79.26,37.67 86.38,37.67 90.76,33.3 DIS3.4 | v75.01,41.8 72.13,38.92 v63.13,38.92
NUM_D  (via drill 0.61)
  Top 0.635: v51.26,36.05 46.51,40.8 IC1.10
  Bottom 0.635: 57.07,34.98 57.26,35.17 68.63,35.17 68.82,34.98 | 57.07,34.98 55.38,33.3 DIS1.2 | 68.82,34.98 70.51,33.3 DIS2.2 | DIS3.2 85.76,33.3 83.88,35.17 69.01,35.17 68.82,34.98 | v51.26,36.05 52.13,35.17 56.88,35.17 57.07,34.98
NUM_E  (via drill 0.61)
  Top 0.635: IC1.9 49.01,40.8 52.51,37.3 52.51,33.55 52.76,33.3 DIS1.1 52.88,32.92 52.88,28.42 v57.63,23.67 | v69.88,24.8 69.88,31.42 68.13,33.17 DIS2.1 | v77.63,24.05 83.26,29.67 DIS3.1
  Bottom 0.635: v77.63,24.05 70.63,24.05 v69.88,24.8 69.63,24.67 68.63,23.67 v57.63,23.67
NUM_F  (via drill 0.61)
  Top 0.635: v43.01,50.92 43.01,50.17 33.76,40.92 IC1.15 | v54.01,52.17 55.26,50.92 55.26,48.55 DIS1.9
  Bottom 0.635: DIS3.9 85.76,48.42 83.88,46.55 72.51,46.55 70.63,48.42 DIS2.9 70.38,48.3 68.63,46.55 57.26,46.55 55.38,48.42 DIS1.9 | v43.01,50.92 44.26,52.17 v54.01,52.17
NUM_G  (via drill 0.61)
  Top 0.635: v42.76,47.55 39.76,44.55 39.76,44.3 36.38,40.92 IC1.14
  Bottom 0.635: v42.76,47.55 43.63,48.42 52.76,48.42 DIS1.10 53.01,48.67 54.63,50.3 66.26,50.3 66.45,50.11 | 66.45,50.11 68.01,48.55 DIS2.10 | DIS3.10 83.26,48.55 82.26,49.55 79.51,49.55 78.76,50.3 66.63,50.3 66.45,50.11
ONES_ENABLE  (via drill 0.61)
  Top 0.635: v73.01,58.55 80.51,51.05 v80.51,28.8
  Bottom 0.635: v73.01,58.55 70.63,58.55 U2.14 | v80.51,28.8 88.26,28.8 Q3.2
RST  (via drill 0.61)
  Top 0.635: v28.38,62.42 26.63,64.17 22.13,64.17 v21.26,63.3 | v16.01,63.3 15.88,63.42 15.88,67.42 17.13,68.67 ISP1.5
  Bottom 0.635: ISP1.5 17.13,68.67 14.26,65.8 8.01,65.8 4.63,62.42 R1.P$1 | v28.38,62.42 U2.1 | v16.01,63.3 v21.26,63.3
S0  (via drill 0.61)
  Top 0.635: v37.38,56.05 37.38,61.42 36.38,62.42 U2.2 | v59.13,54.67 64.38,49.42 64.38,17.67 75.38,6.67 v75.38,4.42 | D1.A 121.76,18.55 120.01,16.8 120.01,8.54 121.38,7.17 S1.P
  Bottom 0.635: v37.38,56.05 38.76,54.67 v59.13,54.67 | v75.38,4.42 76.63,3.17 109.88,3.17 113.76,7.04 121.38,7.04 S1.P
S1  (via drill 0.61)
  Top 0.635: v42.01,53.42 38.63,56.8 38.63,62.3 38.76,62.42 U2.3 | v83.01,52.05 84.51,50.55 v84.51,42.8 | v102.13,35.17 102.13,23.3 105.82,19.61 | 105.82,19.61 106.76,18.67 D2.A | S2.P 107.01,7.17 105.63,8.54 105.63,19.42 105.82,19.61
  Bottom 0.635: v42.01,53.42 81.63,53.42 v83.01,52.05 | v84.51,42.8 92.13,35.17 v102.13,35.17
S2  (via drill 0.61)
  Top 0.635: v44.26,47.17 44.26,59.55 41.38,62.42 U2.4 | v49.51,47.05 56.63,39.92 v56.63,36.42 | v83.01,36.42 84.51,34.92 84.51,25.92 90.32,20.11 | 90.32,20.11 91.76,18.67 D3.A | S3.P 91.51,7.17 90.13,8.54 90.13,19.92 90.32,20.11
  Bottom 0.635: v44.26,47.17 44.38,47.05 v49.51,47.05 | v83.01,36.42 v56.63,36.42
S3  (via drill 0.61)
  Top 0.635: v28.38,58.8 18.01,48.42 v18.01,28.55 | D4.A 76.76,18.55 v74.13,15.92 74.26,15.67 74.26,10.04 77.13,7.17 S4.P
  Bottom 0.635: v28.38,58.8 40.26,58.8 U2.5 | v18.01,28.55 30.63,15.92 v74.13,15.92
S4  (via drill 0.61)
  Top 0.635: v54.13,29.05 54.13,38.05 47.01,45.17 47.01,61.92 46.51,62.42 U2.6 | S5.P 61.63,7.17 60.38,8.42 60.38,17.17 61.76,18.55 D5.A
  Bottom 0.635: v54.13,29.05 54.13,18.67 61.76,18.67 D5.A
S5  (via drill 0.61)
  Top 0.635: v97.13,60.42 98.51,59.05 98.51,52.8 101.13,50.17 101.13,47.42 92.13,38.42 v92.13,27.3 | S6.P 46.01,7.17 44.63,8.54 44.63,17.42 45.76,18.55 D6.A
  Bottom 0.635: v97.13,60.42 80.88,60.42 77.51,63.8 60.51,63.8 U2.11 | v92.13,27.3 82.01,17.17 47.13,17.17 45.76,18.55 D6.A
S6  (via drill 0.61)
  Top 0.635: v49.51,50.92 50.88,50.92 56.76,56.8 56.76,57.55 61.63,62.42 U2.12 | v37.63,49.67 28.63,40.67 28.63,9.79 31.26,7.17 S7.P 31.51,7.42 32.76,8.67 32.76,17.55 31.76,18.55 D7.A
  Bottom 0.635: v49.51,50.92 48.26,49.67 v37.63,49.67
S7  (via drill 0.61)
  Top 0.635: v45.76,58.8 45.51,58.55 45.51,46.42 v42.13,43.05 | v14.51,38.05 14.51,21.92 17.76,18.67 D8.A 17.88,18.42 19.01,17.3 19.01,8.42 17.76,7.17 S8.P
  Bottom 0.635: v45.76,58.8 60.51,58.8 64.13,62.42 U2.13 | v42.13,43.05 41.88,42.8 35.88,42.8 35.01,41.92 35.01,38.05 v14.51,38.05
SCK  (via drill 0.61)
  Top 0.635: 56.51,71.42 32.88,71.42 30.76,69.3 30.76,66.17 28.01,66.17 27.38,66.8 27.38,70.17 21.13,70.17 19.76,68.8 ISP1.3 | 56.51,71.42 56.51,70.05 U2.19 | v106.13,58.42 108.63,55.92 108.63,45.92 113.63,40.92 U3.12 | v87.01,59.17 79.76,66.42 79.76,68.67 77.01,71.42 56.51,71.42
  Bottom 0.635: v106.13,58.42 105.38,59.17 v87.01,59.17
SCORE_A  (via drill 0.61)
  Top 0.635: v96.38,65.8 92.26,69.92 DIS5.7 | DIS4.7 107.38,69.92 107.38,66.92 v106.13,65.67 106.26,65.42 112.38,59.3 112.38,53.55 121.26,53.55 IC2.13
  Bottom 0.635: v96.38,65.8 96.51,65.67 v106.13,65.67
SCORE_B  (via drill 0.61)
  Top 0.635: v97.63,66.92 97.63,67.05 94.76,69.92 DIS5.6 | 109.88,68.17 v108.63,66.92 | 109.88,68.17 109.88,69.92 DIS4.6 | IC2.12 121.38,56.17 123.26,58.05 123.26,64.17 119.38,68.05 110.13,68.05 109.88,68.17
  Bottom 0.635: v108.63,66.92 v97.63,66.92
SCORE_C  (via drill 0.61)
  Top 0.635: v94.63,57.92 94.63,57.3 92.26,54.92 DIS5.4
  Bottom 0.635: v94.63,57.92 104.38,57.92 107.38,54.92 DIS4.4 109.88,57.3 120.01,57.3 121.26,58.55 IC2.11
SCORE_D  (via drill 0.61)
  Top 0.635: v116.26,56.05 121.26,61.05 IC2.10
  Bottom 0.635: 100.57,53.11 102.26,54.8 DIS4.2 | 100.57,53.11 100.38,52.92 89.01,52.92 87.13,54.8 DIS5.2 | v116.26,56.05 113.13,52.92 100.76,52.92 100.57,53.11
SCORE_E  (via drill 0.61)
  Top 0.635: v103.63,60.42 99.88,56.67 99.88,54.92 DIS4.1
  Bottom 0.635: DIS5.1 84.63,54.92 86.38,56.67 98.01,56.67 99.76,54.92 DIS4.1 | v103.63,60.42 106.76,60.42 110.51,64.17 120.88,64.17 121.26,63.8 IC2.9
SCORE_F  (via drill 0.61)
  Top 0.635: 95.88,50.42 91.63,50.42 88.26,53.8 88.26,68.8 87.13,69.92 DIS5.9 | 95.88,50.42 95.88,60.55 95.13,61.3 95.13,62.55 102.26,69.67 102.26,69.92 DIS4.9 | v99.88,49.55 96.01,49.55 96.01,50.17 95.88,50.42
  Bottom 0.635: v99.88,49.55 120.26,49.55 121.26,48.55 IC2.15
SCORE_G
  Bottom 0.635: 98.2,68.36 99.76,69.92 DIS4.10 | 98.2,68.36 98.01,68.17 86.38,68.17 84.63,69.92 DIS5.10 | IC2.14 121.38,51.05 123.26,52.92 123.26,68.17 98.38,68.17 98.2,68.36
SCORE_ONES_ENABLE
  Bottom 0.635: U2.28 33.76,69.92 35.01,68.67 74.63,68.67 75.26,69.3 76.88,69.3 Q4.2
SCORE_TENS_ENABLE  (via drill 0.61)
  Top 0.635: v32.01,68.67 35.01,68.67 36.26,69.92 U2.27 | v100.88,22.67 100.88,45.3 103.38,47.8 104.76,47.8 Q5.2
  Bottom 0.635: v32.01,68.67 26.63,68.67 22.51,64.55 8.76,64.55 3.76,59.55 3.26,59.55 1.38,57.67 1.38,11.54 89.76,11.54 v100.88,22.67
TENS_ENABLE  (via drill 0.61)
  Top 0.635: v81.76,30.05 81.76,51.67 74.13,59.3 74.13,69.92 66.76,69.92 U2.15
  Bottom 0.635: v81.76,30.05 74.38,30.05 73.13,28.8 Q2.2
VCC  (via drill 0.61)
  Top 0.635: U2.20 54.01,69.92 54.01,67.42 49.01,62.42 U2.7 48.88,62.17 48.26,61.55 v48.26,45.8 | IC1.4 38.76,33.3 36.38,33.3 IC1.3 36.01,33.05 36.01,31.3 30.76,31.3 | 30.76,31.3 29.88,32.17 29.88,39.55 31.13,40.8 IC1.16 | v19.76,62.05 19.76,63.67 22.26,66.17 ISP1.2 | PWR.P 8.38,31.92 13.13,27.17 13.13,17.17 17.63,12.67 17.63,9.79 S8.S | v8.26,57.05 11.63,60.42 11.63,61.92 R1.P$2 | 30.76,31.3 30.63,31.05 30.26,30.67 30.26,10.79 31.26,9.79 S7.S | IC2.3 129.01,51.05 129.01,53.42 IC2.4 | IC2.16 121.26,45.8 118.88,43.42 118.88,40.92 U3.10 118.88,40.55 123.26,36.17 123.26,11.54 121.51,9.79 S1.S
  Bottom 0.635: v48.26,45.8 36.13,45.8 31.26,40.92 IC1.16 | v19.76,62.05 12.63,62.05 12.26,62.42 R1.P$2 | S8.S 17.76,9.79 31.26,9.79 S7.S 31.63,9.79 46.01,9.79 S6.S 46.26,9.79 61.51,9.79 S5.S 61.76,9.79 77.13,9.79 S4.S 77.38,9.79 91.51,9.79 S3.S 91.88,9.79 106.76,9.79 S2.S 107.13,9.79 121.38,9.79 S1.S | v8.26,57.05 3.38,57.05 2.76,56.42 2.76,33.42 6.88,33.42 8.26,32.05 PWR.P | U3.16 103.63,40.92 104.88,42.17 117.51,42.17 118.76,40.92 U3.10 | IC2.3 128.88,50.92 123.88,45.92 121.38,45.92 IC2.16

### Text on the board
tPlace: 128 | 64 | 32 | 16 | 8 | 4 | 2 | 1
bPlace: Ethan Peterson / RSGC ACES 2018